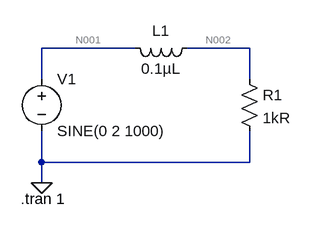
[diagram p0: schematic Draft2.asc]
Draft2.asc, the LTspice schematic file:
Version 4
SHEET 1 880 680
WIRE -448 -96 -592 -96
WIRE -272 -96 -368 -96
WIRE -592 -48 -592 -96
WIRE -272 -48 -272 -96
WIRE -592 80 -592 32
WIRE -272 80 -272 32
WIRE -272 80 -592 80
WIRE -592 112 -592 80
FLAG -592 112 0
SYMBOL voltage -592 -64 R0
WINDOW 123 0 0 Left 0
WINDOW 39 0 0 Left 0
SYMATTR InstName V1
SYMATTR Value SINE(0 2 1000)
SYMBOL res -288 -64 R0
SYMATTR InstName R1
SYMATTR Value 1kR
SYMBOL ind -352 -112 R90
WINDOW 0 5 56 VBottom 2
WINDOW 3 32 56 VTop 2
SYMATTR InstName L1
SYMATTR Value 0.1µL
TEXT -624 136 Left 2 !.tran 1

The netlist it stands for:
* Draft2.asc
V1 N001 0 SINE(0 2 1000)
R1 N002 0 1kR
L1 N002 N001 0.1µL
.tran 1
.backanno
.end

* Results of the author's LTspice run, read from the files saved beside the schematic
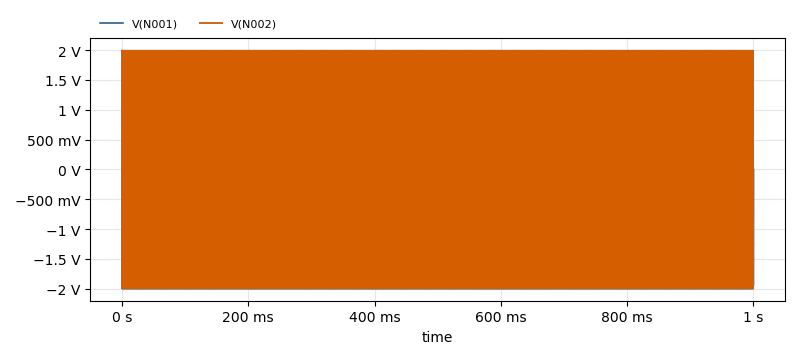
[diagram p1: Transient Analysis of Draft2.asc, plotted from the saved traces]
* Transient Analysis, 1 run:
*   V(N001): min -2 V, max 2 V, average 0 V, rms 1.423 V, last 0 V
*   V(N002): min -1.995 V, max 1.995 V, average 286 nV, rms 1.399 V, last 3.711 µV